# Altium project Torch-BusinessCard.PrjPcb
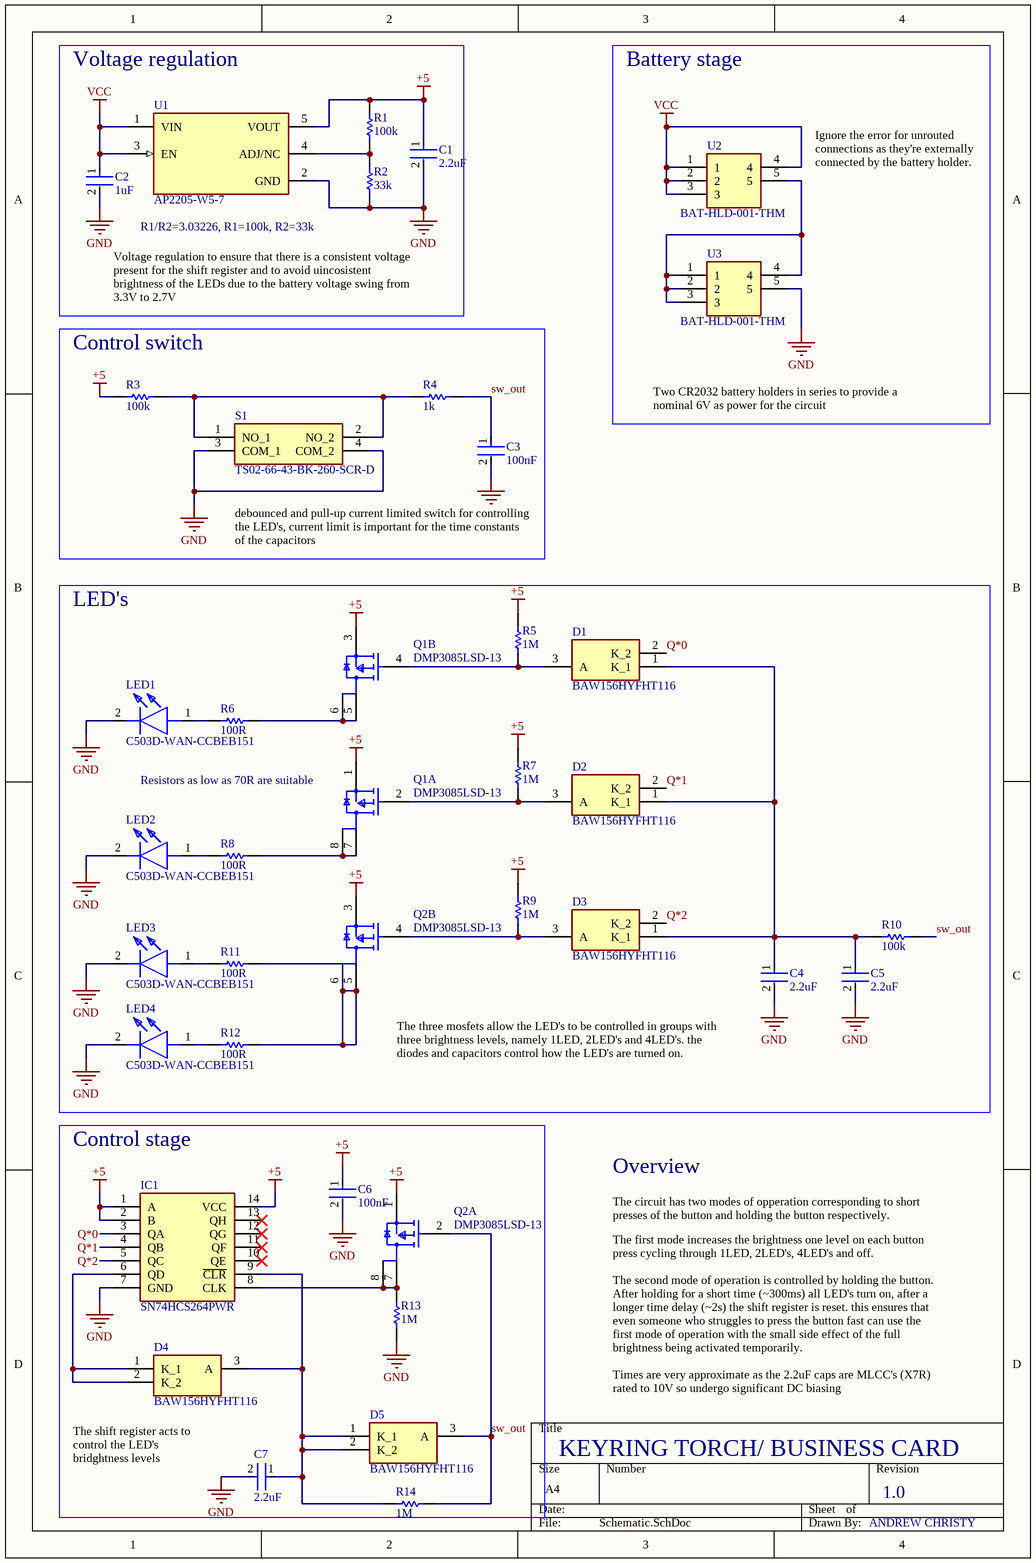
[diagram p0: Schematic.SchDoc]
1 sheet, 37 parts. Net scope: global (net labels, ports and power ports of the same name join across sheets).
Board files: PCB-silkscreen.PcbDoc, PCB-soldermask.PcbDoc

## Sheet Schematic.SchDoc
size A4 portrait; SheetNumber: 1; SheetTotal: 1

### Parts
C1  2.2uF  [FP-GRM188-0_1-e0_2_0_55-IPC_A]
C2  1uF  [FP-GRM188-0_1-e0_2_0_55-IPC_A]
C3  100nF  [FP-GRM188-0_1-e0_2_0_55-IPC_A]
C4  2.2uF  [FP-GRM188-0_1-e0_2_0_55-IPC_A]
C5  2.2uF  [FP-GRM188-0_1-e0_2_0_55-IPC_A]
C6  100nF  [FP-GRM188-0_1-e0_2_0_55-IPC_A]
C7  2.2uF  [FP-GRM188-0_1-e0_2_0_55-IPC_A]
D1  BAW156HYFHT116  [SOT95P240X115-3N]
D2  BAW156HYFHT116  [SOT95P240X115-3N]
D3  BAW156HYFHT116  [SOT95P240X115-3N]
D4  BAW156HYFHT116  [SOT95P240X115-3N]
D5  BAW156HYFHT116  [SOT95P240X115-3N]
IC1  SN74HCS264PWR  [SOP65P640X120-14N]
LED1  C503D-WAN-CCBEB151  [C503DWANCCBEB151]
LED2  C503D-WAN-CCBEB151  [C503DWANCCBEB151]
LED3  C503D-WAN-CCBEB151  [C503DWANCCBEB151]
LED4  C503D-WAN-CCBEB151  [C503DWANCCBEB151]
Q1  DMP3085LSD-13  [FP-SO-8-MFG]  (parts A,B of 2)
Q2  DMP3085LSD-13  [FP-SO-8-MFG]  (parts A,B of 2)
R1  100k  [RESC1609X50X30NL8T20]
R2  33k  [RESC1609X50X30NL8T20]
R3  100k  [RESC1609X50X30NL8T20]
R4  1k  [RESC1609X50X30NL8T20]
R5  1M  [RESC1609X50X30NL8T20]
R6  100R  [RESC1609X50X30NL8T20]
R7  1M  [RESC1609X50X30NL8T20]
R8  100R  [RESC1609X50X30NL8T20]
R9  1M  [RESC1609X50X30NL8T20]
R10  100k  [RESC1609X50X30NL8T20]
R11  100R  [RESC1609X50X30NL8T20]
R12  100R  [RESC1609X50X30NL8T20]
R13  1M  [RESC1609X50X30NL8T20]
R14  1M  [RESC1609X50X30NL8T20]
S1  TS02-66-43-BK-260-SCR-D  [TS026643BK260SCRD]
U1  AP2205-W5-7  [FP-SOT25-MFG]
U2  BAT-HLD-001-THM  [BATHLD001THM]
U3  BAT-HLD-001-THM  [BATHLD001THM]

### Blocks framed on the sheet
Voltage regulation: C1 C2 R1 R2 U1
Battery stage: U2 U3
Control switch: C3 R3 R4 S1
LED's: C4 C5 D1-D3 LED1-LED4 Q1 Q2 R5-R12
Control stage: C6 C7 D4 D5 IC1 Q2 R13 R14

### Nets
+5: C1.1 C6.1 IC1.1(A) IC1.2(B) IC1.14(VCC) Q1.1(S1) Q1.3(S2) Q2.1(S1) Q2.3(S2) R1.2 R3.2 R5.2 R7.2 R9.2 U1.5(VOUT)
GND: C1.2 C2.2 C3.2 C4.2 C5.2 C6.2 C7.2 IC1.7(GND) LED1.2(K) LED2.2(K) LED3.2(K) LED4.2(K) R2.1 R13.1 S1.3(COM_1) S1.4(COM_2) U1.2(GND) U3.5
VCC: C2.1 U1.1(VIN) U1.3(EN) U2.1 U2.2 U2.3 U2.4
Q*0: D1.2(K_2) IC1.3(QA)
Q*1: D2.2(K_2) IC1.4(QB)
Q*2: D3.2(K_2) IC1.5(QC)
sw_out: C3.1 D5.3(A) Q2.2(G1) R4.1 R10.1 R14.1
NetC4_1: C4.1 C5.1 D1.1(K_1) D2.1(K_1) D3.1(K_1) R10.2
NetC7_1: C7.1 D4.3(A) D5.1(K_1) D5.2(K_2) IC1.9(~{CLR}) R14.2
NetD1_3: D1.3(A) Q1.4(G2) R5.1
NetD2_3: D2.3(A) Q1.2(G1) R7.1
NetD3_3: D3.3(A) Q2.4(G2) R9.1
NetD4_1: D4.1(K_1) D4.2(K_2) IC1.6(QD)
NetIC1_8: IC1.8(CLK) Q2.7(D1) Q2.8(D1) R13.2
NetLED1_1: LED1.1(A) R6.2
NetLED2_1: LED2.1(A) R8.2
NetLED3_1: LED3.1(A) R11.2
NetLED4_1: LED4.1(A) R12.2
NetQ1_5: Q1.5(D2) Q1.6(D2) R6.1
NetQ1_7: Q1.7(D1) Q1.8(D1) R8.1
NetQ2_5: Q2.5(D2) Q2.6(D2) R11.1 R12.1
NetR1_1: R1.1 R2.2 U1.4(ADJ/NC)
NetR3_1: R3.1 R4.2 S1.1(NO_1) S1.2(NO_2)
NetU2_5: U2.5 U3.1 U3.2 U3.3 U3.4

Not connected (* = marked no-connect by the designer): IC1 10(QE)* 11(QF)* 12(QG)* 13(QH)*

### Notes on the sheet
- Ignore the error for unrouted connections as they're externally connected by the battery holder.
- R1/R2=3.03226, R1=100k, R2=33k
- Voltage regulation to ensure that there is a consistent voltage present for the shift register and to avoid uincosistent brightness of the LEDs due to the battery voltage swing from 3.3V to 2.7V
- Two CR2032 battery holders in series to provide a nominal 6V as power for the circuit
- debounced and pull-up current limited switch for controlling the LED's, current limit is important for the time constants of the capacitors
- (near Q1) Resistors as low as 70R are suitable
- The three mosfets allow the LED's to be controlled in groups with three brightness levels, namely 1LED, 2LED's and 4LED's. the diodes and capacitors control how the LED's are turned on.
- Overview
- The circuit has two modes of opperation corresponding to short presses of the button and holding the button respectively.
- The first mode increases the brightness one level on each button press cycling through 1LED, 2LED's, 4LED's and off.
- The second mode of operation is controlled by holding the button. After holding for a short time (~300ms) all LED's turn on, after a longer time delay (~2s) the shift register is reset. this ensures that even someone who struggles to press the button fast can use the first mode of operation with the small side effect of the full brightness being activated temporarily.
- Times are very approximate as the 2.2uF caps are MLCC's (X7R) rated to 10V so undergo significant DC biasing
- The shift register acts to control the LED's bridghtness levels
- KEYRING TORCH/ BUSINESS CARD
- 1.0
- ANDREW CHRISTY

### Library data of the parts
C1-C7 = CMP-2006-02792-2: Chip Multilayer Ceramic Capacitors for General Purpose, 0603, 10uF, X5R, 15%, 20%, 6.3V; Packaging: Tape and Reel; Voltage Rating (DC): 6.3V; Width: 0.031inch; Termination: SMD/SMT; Dielectric: X5R; Package Quantity: 4000; Voltage Rating: 6.3V; Capacitance: 10uF; Case/Package: 0603; Min Operating Temperature: -55°C; Voltage: 6.3V; Length: 1.6mm; Thickness: 0.035inch; Lead Free: Lead Free; Depth: 0.8mm; Case Code (Imperial): 0603; Max Operating Temperature: 85°C; Material: Ceramic; Height: 0.8mm; Tolerance: 20%; Mount: Surface Mount; REACH SVHC: No SVHC; Radiation Hardening: No; Case Code (Metric): 1608
D1-D5 = BAW156HYFHT116: Diode; Manufacturer_Name: ROHM Semiconductor; Datasheet Link: https://fscdn.rohm.com/en/products/databook/datasheet/discrete/diode/switching/baw156hyfht116-e.pdf; Height: 1.15mm; Manufacturer_Part_Number: BAW156HYFHT116
IC1 = SN74HCS264PWR: Integrated Circuit; Manufacturer_Name: Texas Instruments; Datasheet Link: https://www.ti.com/lit/gpn/SN74HCS264; Height: 1.2mm; Manufacturer_Part_Number: SN74HCS264PWR; Mouser Part Number: 595-SN74HCS264PWR; Mouser Price/Stock: https://www.mouser.co.uk/ProductDetail/Texas-Instruments/SN74HCS264PWR?qs=DPoM0jnrROVriykd1NESjA%3D%3D; Arrow Part Number: SN74HCS264PWR; Arrow Price/Stock: https://www.arrow.com/en/products/sn74hcs264pwr/texas-instruments?region=nac
LED1-LED4 = C503D-WAN-CCBEB151: LED; Manufacturer_Name: Wolfspeed; Datasheet Link: https://www.cree.com/led-components/media/documents/C503D-WAN-935.pdf; Height: 10.1mm; Manufacturer_Part_Number: C503D-WAN-CCBEB151; Mouser Part Number: 941-C503DWANCCBEB151; Mouser Price/Stock: https://www.mouser.co.uk/ProductDetail/Cree-LED/C503D-WAN-CCbEb151?qs=1sbE9T7hb3ZR2lckThU%2FFA%3D%3D; Arrow Part Number: C503D-WAN-CCBEB151; Arrow Price/Stock: https://www.arrow.com/en/products/c503d-wan-ccbeb151/cree
Q1 Q2 = CMP-12801-000030-1: MOSFET 2P-CH 30V 3.9A 8SO; Manufacturer: Diodes Inc.; Max Forward Diode Voltage: -1.2V; Turn Off Delay Time: 31ns; Rthja Max: 107°C/W; Number Of P Channels: 2; Typ Forward Diode Voltage: -0.7V; Gate To Source Voltage: 20V; Threshold Vgs Min: -1V; Depletion Mode: False; Drain To Source Voltage: -30V; Drain To Source Resistance: 50mΩ; Turn On Delay Time: 4.8ns; Pulse Drain Current: -20A; Gate Charge At Vgs: 11nC @ -10V; Input Capacitace At Vds: 563pF @ -25V; Threshold Vgs Max: -3V; Max Junction Temp: +150°C; Standoff Height: 0.1mm; Continuous Drain Current: -3.9A; Power Dissipation: 1.1W; Package: SO-8; ComponentLink2URL: https://www.diodes.com/assets/Datasheets/DMP3085LSD.pdf; Manufacturer Part Number: DMP3085LSD-13; Category: Trans; Device Class L2: Transistors; Lead Free: Yes; Height: 1.7mm; Device Class L3: MOSFETs; Automotive: No; Footprint Url: https://www.diodes.com/assets/Package-Files/SO-8.pdf; Ipc Land Pattern Name: SOIC127P600X160-8; ComponentLink2Description: Datasheet; Temperature Range High: +150°C; Number Of Channels: 2; Temperature Range Low: -55°C; RoHS: TRUE; Digikey Description: MOSFET 2P-CH 30V 3.9A 8SO; Temperature: -55°C to +150°C; Mouser Description: MOSFET P-Ch ENH FET -30V 70mOhm -10V -3.9A; Octopart: https://octopart.com/dmp3085lsd-13-diodes+inc.-29925597; Drain To Source Breakdown Voltage: -30V; Device Class L1: Discrete Semiconductors
R1-R14 = CMP-2000-03816-5: Chip Resistor, 0 Ohm, Jumper, 100 mW, -55 to 155 degC, 0603 (1608 Metric), RoHS, Tape and Reel; Manufacturer: Vishay Semiconductor; Voltage Rating: 75 V; Package Quantity: 5000; DatasheetVersion: 06/2012; Min Operating Temperature: -55 degC; ComponentLink1URL: http://www.vishay.com/; Mounting Technology: Surface Mount; Height: 0.45 mm; ComponentLink1Description: Manufacturer URL; REACH SVHC: Unknown; PackageReference: 0603; Packaging: Tape and Reel; Max Operating Temperature: 155 degC; Mount: Surface Mount; ComponentLink2Description: Datasheet; PackageDescription: 2-Pin Surface Mount Device, Body 1.575 x 0.85 mm; Length: 1.55 mm; ComponentLink2URL: http://www.vishay.com/docs/20035/dcrcwe3.pdf; Pins: 2; RoHSCompliant: true
S1 = TS02-66-43-BK-260-SCR-D: Switch; Manufacturer_Name: CUI Inc.; Datasheet Link: https://www.arrow.com/en/products/ts02-66-43-bk-260-scr-d/cui-devices?region=nac; Height: 4.5mm; Manufacturer_Part_Number: TS02-66-43-BK-260-SCR-D; Mouser Part Number: 179-TS026643BK260SCR; Mouser Price/Stock: https://www.mouser.co.uk/ProductDetail/CUI-Devices/TS02-66-43-BK-260-SCR-D?qs=A6eO%252BMLsxmStfetPfb1PWw%3D%3D; Arrow Part Number: TS02-66-43-BK-260-SCR-D; Arrow Price/Stock: https://www.arrow.com/en/products/ts02-66-43-bk-260-scr-d/cui-devices?region=nac
U1 = CMP-12756-000046-1: IC REG LIN POS ADJ 250MA SOT25
U2 U3 = BAT-HLD-001-THM: Undefined or Miscellaneous; Manufacturer_Name: Linx Technologies; Datasheet Link: http://www.mouser.com/datasheet/2/238/BAT-HLD-001-THM Diagram-1175214.pdf; Height: 4.2mm; Manufacturer_Part_Number: BAT-HLD-001-THM; Mouser Part Number: 712-BAT-HLD-001-THM; Mouser Price/Stock: https://www.mouser.co.uk/ProductDetail/Linx-Technologies/BAT-HLD-001-THM?qs=Z0V%2FpEl%252BOGcluj3h2QTrDw%3D%3D